# Altium schematic sheet Ai.SchDoc
size A3
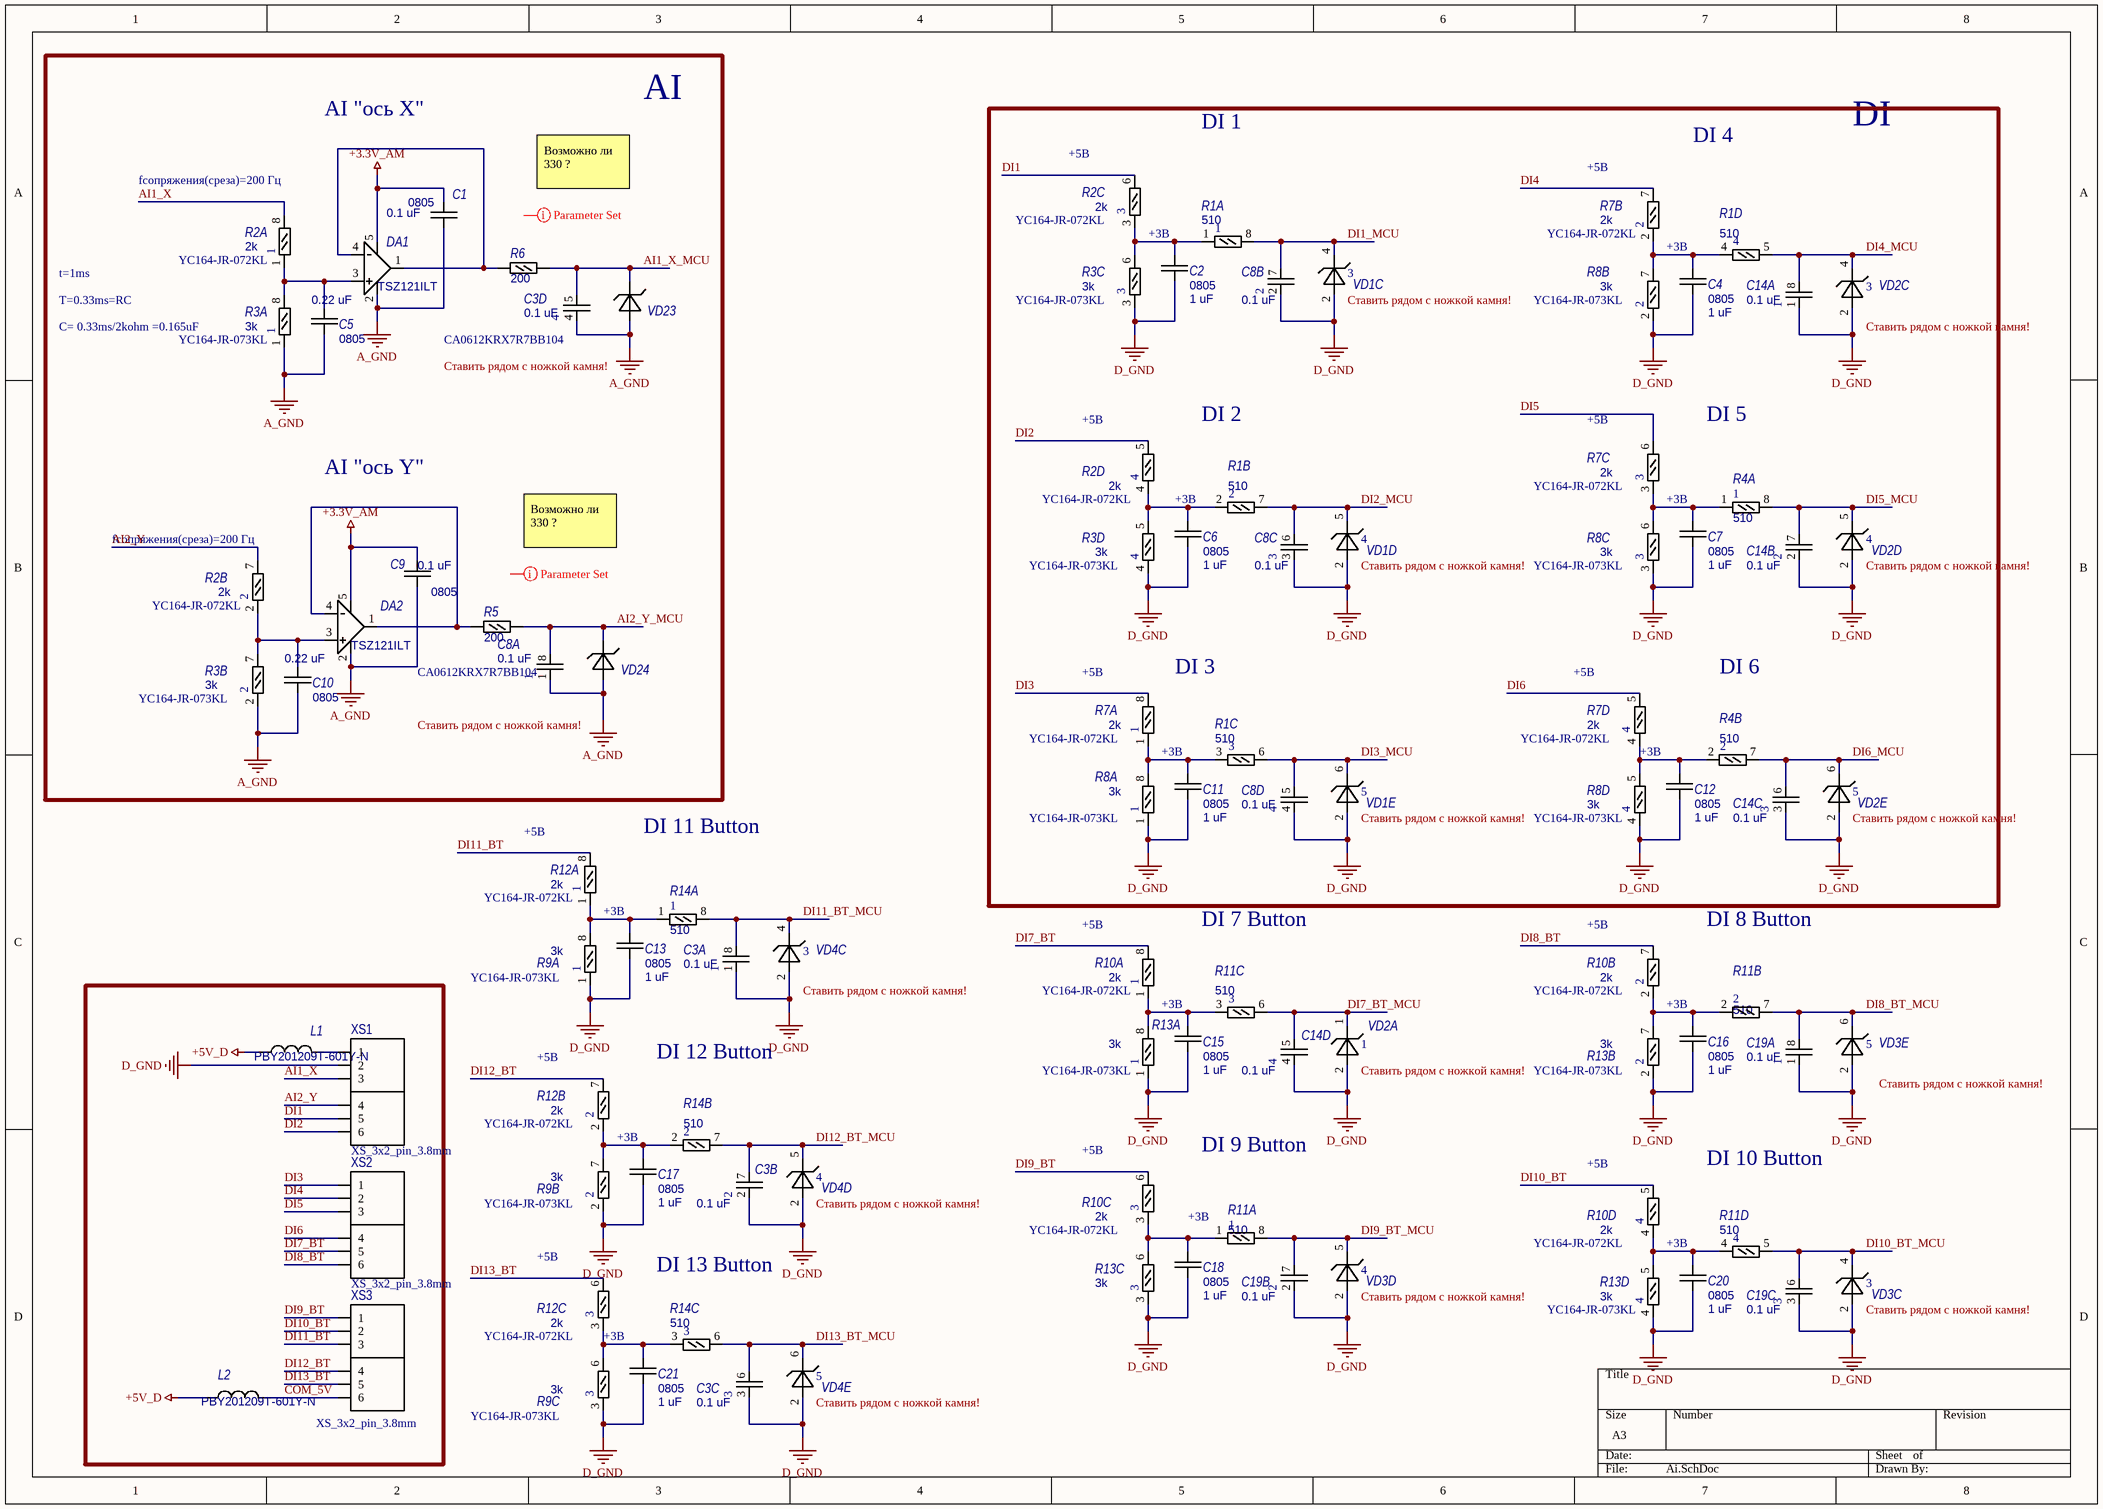
[diagram p0: Ai.SchDoc]

## Parts
C1  0805  Номинал: 0.1 uF  [CAP_0805_(2x1.25x1.3)]
C2  0805  Номинал: 1 uF  [CAP_0805_(2x1.25x1.3)]
C3  Номинал: 0.1 uF  [CA0612]  (hidden comment: Cборка 4 шт)  (parts A,B,C,D of 4)
C4  0805  Номинал: 1 uF  [CAP_0805_(2x1.25x1.3)]
C5  0805  Номинал: 0.22 uF  [CAP_0805_(2x1.25x1.3)]
C6  0805  Номинал: 1 uF  [CAP_0805_(2x1.25x1.3)]
C7  0805  Номинал: 1 uF  [CAP_0805_(2x1.25x1.3)]
C8  Номинал: 0.1 uF  Идентификатор: CA0612KRX7R7BB104  [CA0612]  (hidden comment: Cборка 4 шт)  (parts A,B,C,D of 4)
C9  0805  Номинал: 0.1 uF  [CAP_0805_(2x1.25x1.3)]
C10  0805  Номинал: 0.22 uF  [CAP_0805_(2x1.25x1.3)]
C11  0805  Номинал: 1 uF  [CAP_0805_(2x1.25x1.3)]
C12  0805  Номинал: 1 uF  [CAP_0805_(2x1.25x1.3)]
C13  0805  Номинал: 1 uF  [CAP_0805_(2x1.25x1.3)]
C14  Номинал: 0.1 uF  [CA0612]  (hidden comment: Cборка 4 шт)  (parts A,B,C,D of 4)
C15  0805  Номинал: 1 uF  [CAP_0805_(2x1.25x1.3)]
C16  0805  Номинал: 1 uF  [CAP_0805_(2x1.25x1.3)]
C17  0805  Номинал: 1 uF  [CAP_0805_(2x1.25x1.3)]
C18  0805  Номинал: 1 uF  [CAP_0805_(2x1.25x1.3)]
C19  Номинал: 0.1 uF  [CA0612]  (hidden comment: Cборка 4 шт)  (parts A,B,C of 4)
C20  0805  Номинал: 1 uF  [CAP_0805_(2x1.25x1.3)]
C21  0805  Номинал: 1 uF  [CAP_0805_(2x1.25x1.3)]
DA1  Наименование: TSZ121ILT  [SOT-23-5]  (hidden comment: Op Amp)
DA2  Наименование: TSZ121ILT  [SOT-23-5]  (hidden comment: Op Amp)
L1  PBY201209T-601Y-N  [L_0805]
L2  PBY201209T-601Y-N  [L_0805]
R1  Номинал: 510  [YC-164]  (hidden comment: сборка 4шт)  (parts A,B,C,D of 4)
R2  Номинал: 2k  Идентификатор: YC164-JR-072KL  [YC-164]  (hidden comment: сборка 4шт)  (parts A,B,C,D of 4)
R3  Номинал: 3k  Идентификатор: YC164-JR-073KL  [YC-164]  (hidden comment: сборка 4шт)  (parts A,B,C,D of 4)
R4  Номинал: 510  [YC-164]  (hidden comment: сборка 4шт)  (parts A,B of 4)
R5  Номинал: 200  [RES_0805_(2x1.2x0.45)_0.125Вт]  (hidden comment: 0805)
R6  Номинал: 200  [RES_0805_(2x1.2x0.45)_0.125Вт]  (hidden comment: 0805)
R7  Номинал: 2k  Идентификатор: YC164-JR-072KL  [YC-164]  (hidden comment: сборка 4шт)  (parts A,B,C,D of 4)
R8  Номинал: 3k  Идентификатор: YC164-JR-073KL  [YC-164]  (hidden comment: сборка 4шт)  (parts A,B,C,D of 4)
R9  Номинал: 3k  Идентификатор: YC164-JR-073KL  [YC-164]  (hidden comment: сборка 4шт)  (parts A,B,C of 4)
R10  Номинал: 2k  Идентификатор: YC164-JR-072KL  [YC-164]  (hidden comment: сборка 4шт)  (parts A,B,C,D of 4)
R11  Номинал: 510  [YC-164]  (hidden comment: сборка 4шт)  (parts A,B,C,D of 4)
R12  Номинал: 2k  Идентификатор: YC164-JR-072KL  [YC-164]  (hidden comment: сборка 4шт)  (parts A,B,C of 4)
R13  Номинал: 3k  Идентификатор: YC164-JR-073KL  [YC-164]  (hidden comment: сборка 4шт)  (parts A,B,C,D of 4)
R14  Номинал: 510  [YC-164]  (hidden comment: сборка 4шт)  (parts A,B,C of 4)
VD1  сборка 5шт  [SOT-363]  (value not drawn)  (parts C,D,E of 5)
VD2  сборка 5шт  [SOT-363]  (value not drawn)  (parts A,C,D,E of 5)
VD3  сборка 5шт  [SOT-363]  (value not drawn)  (parts C,D,E of 5)
VD4  сборка 5шт  [SOT-363]  (value not drawn)  (parts C,D,E of 5)
VD23  ESD  [VD_SOD523]  (value not drawn)
VD24  ESD  [VD_SOD523]  (value not drawn)
XS1  XS_3x2_pin_3.8mm  [XS_KLS_3x2_Pin _3.8mm]
XS2  XS_3x2_pin_3.8mm  [XS_KLS_3x2_Pin _3.8mm]
XS3  XS_3x2_pin_3.8mm  [XS_KLS_3x2_Pin _3.8mm]

## Blocks framed on the sheet
AI: C1 C3 C5 C8-C10 DA1 DA2 R2 R3 R5 R6 VD23 VD24
DI: C2 C4 C6-C8 C11 C12 C14 R1-R4 R7 R8 VD1 VD2

## Nets
+3.3V_AM: C1.2 C9.2 DA1.5(Vdd) DA2.5(Vdd)
+5V_D: L1.1 L2.1
A_GND: C1.1 C3.4 C5.1 C8.1 C9.1 C10.1 DA1.2(Vss) DA2.2(Vss) R3.1 R3.2 VD23.1(A) VD24.1(A)
D_GND: C2.1 C3.1 C3.2 C3.3 C4.1 C6.1 C7.1 C8.2 C8.3 C8.4 C11.1 C12.1 C13.1 C14.1 C14.2 C14.3 C14.4 C15.1 C16.1 C17.1 C18.1 C19.1 C19.2 C19.3 C20.1 C21.1 R3.3 R3.4 R8.1 R8.2 R8.3 R8.4 R9.1 R9.2 R9.3 R13.1 R13.2 R13.3 R13.4 VD1.2(A) VD2.2(A) VD3.2(A) VD4.2(A) XS1.2
AI1_X: R2.8 XS1.3
AI1_X_MCU: C3.5 R6.1 VD23.2(K)
AI2_Y: R2.7 XS1.4
AI2_Y_MCU: C8.8 R5.1 VD24.2(K)
COM_5V: L2.2 XS3.6
DI1: R2.6 XS1.5
DI1_MCU: C8.7 R1.8 VD1.4(K)
DI2: R2.5 XS1.6
DI2_MCU: C8.6 R1.7 VD1.5(K)
DI3: R7.8 XS2.1
DI3_MCU: C8.5 R1.6 VD1.6(K)
DI4: R7.7 XS2.2
DI4_MCU: C14.8 R1.5 VD2.4(K)
DI5: R7.6 XS2.3
DI5_MCU: C14.7 R4.8 VD2.5(K)
DI6: R7.5 XS2.4
DI6_MCU: C14.6 R4.7 VD2.6(K)
DI7_BT: R10.8 XS2.5
DI7_BT_MCU: C14.5 R11.6 VD2.1(K)
DI8_BT: R10.7 XS2.6
DI8_BT_MCU: C19.8 R11.7 VD3.6(K)
DI9_BT: R10.6 XS3.1
DI9_BT_MCU: C19.7 R11.8 VD3.5(K)
DI10_BT: R10.5 XS3.2
DI10_BT_MCU: C19.6 R11.5 VD3.4(K)
DI11_BT: R12.8 XS3.3
DI11_BT_MCU: C3.8 R14.8 VD4.4(K)
DI12_BT: R12.7 XS3.4
DI12_BT_MCU: C3.7 R14.7 VD4.5(K)
DI13_BT: R12.6 XS3.5
DI13_BT_MCU: C3.6 R14.6 VD4.6(K)
NetC2_2: C2.2 R1.1 R2.3 R3.6
NetC4_2: C4.2 R1.4 R7.2 R8.7
NetC5_2: C5.2 DA1.3(VinA+) R2.1 R3.8
NetC6_2: C6.2 R1.2 R2.4 R3.5
NetC7_2: C7.2 R4.1 R7.3 R8.6
NetC10_2: C10.2 DA2.3(VinA+) R2.2 R3.7
NetC11_2: C11.2 R1.3 R7.1 R8.8
NetC12_2: C12.2 R4.2 R7.4 R8.5
NetC13_2: C13.2 R9.8 R12.1 R14.1
NetC15_2: C15.2 R10.1 R11.3 R13.8
NetC16_2: C16.2 R10.2 R11.2 R13.7
NetC17_2: C17.2 R9.7 R12.2 R14.2
NetC18_2: C18.2 R10.3 R11.1 R13.6
NetC20_2: C20.2 R10.4 R11.4 R13.5
NetC21_2: C21.2 R9.6 R12.3 R14.3
NetDA1_1: DA1.1(VoutA) DA1.4(VinA-) R6.2
NetDA2_1: DA2.1(VoutA) DA2.4(VinA-) R5.2
NetL1_2: L1.2 XS1.1

## Notes on the sheet
- AI "ось X"
- +5В
- DI 1
- DI 4
- (near R2) fсопряжения(среза)=200 Гц
- Возможно ли 330 ?
- +3В
- t=1ms
- T=0.33ms=RC
- (near VD1) Ставить рядом с ножкой камня!
- C= 0.33ms/2kohm =0.165uF
- Ставить рядом с ножкой камня!
- (near VD2) Ставить рядом с ножкой камня!
- DI 2
- DI 5
- AI "ось Y"
- (near R7) DI 3
- DI 6
- (near R7) +3В
- DI 11 Button
- DI 7 Button
- DI 8 Button
- (near VD4) Ставить рядом с ножкой камня!
- DI 12 Button
- (near VD3) Ставить рядом с ножкой камня!
- DI 9 Button
- DI 10 Button
- DI 13 Button
- (near R12) +3В

## Library data of the parts
C1 C9 = C_0805: Керамика; Тип: Конденсатор; Наименование: CC0805KRX7R9BB104; Аналог: GRM21BR71H104K; Корпус: 0805; Идентификатор: CC0805KRX7R9BB104
C2 C4 C6 C7 C11-C13 C15-C18 C20 C21 = C_0805: Керамика; Тип: Конденсатор; Наименование: TCC0805X7R105K500FT; Аналог: GRM21BR71H105K; Корпус: 0805; Идентификатор: TCC0805X7R105K500FT
C3 C14 C19 = C_CA0612KRX7R7BB: Capacitor 4; Тип: Конденсатор; Наименование: CA0612KRX7R7BB104; Корпус: SMD 0612; Идентификатор: CA0612KRX7R7BB104
C5 C10 = C_0805: Керамика; Тип: Конденсатор; Наименование: TCC0805X7R224K500DT; Аналог: GRM21BR71H224K; Корпус: 0805; Идентификатор: TCC0805X7R224K500DT
C8 = C_CA0612KRX7R7BB: Capacitor 4; Тип: Конденсатор; Корпус: SMD 0612; Наименование: CA0612KRX7R7BB104
DA1 DA2 = DA_TSZ121ILT: Rail to Rail Op Amp; Тип: Операционный усилитель; Корпус: SOT23-5; Примечания: Rail to Rail; Идентификатор: TSZ121ILT
L1 L2 = L_PBY201209T-601Y-N: L; Тип: Индуктивность; Наименование: PBY201209T-601Y-N
R1 R4 R11 R14 = R_YC164-JR-07: Resistor 4; Тип: Резистор; Корпус: 0805; Наименование: YC164-JR-07510RL; Идентификатор: YC164-JR-07510RL
R2 R3 R7-R10 R12 R13 = R_YC164-JR-07: Resistor 4; Тип: Резистор; Корпус: 0805
  R2 R7 R10 R12: Наименование: YC164-JR-072KL
  R3 R8 R9 R13: Наименование: YC164-JR-073KL
R5 R6 = R_0805: Resistor; Тип: Резистор; Наименование: RC0805JR-07200RL; Корпус: 0805; Идентификатор: RC0805JR-07200RL
VD1-VD4 = VD_PESD3V3L5UY: Защитный диод; Корпус: SMC; Напряжение: 3.3V; Тип: Диод; Наименование: PESD3V3L5UY; Идентификатор: PESD3V3L5UY
VD23 VD24 = VD_ESD: Защитный диод; Корпус: SOD523; Наименование: ESD5Z3.3T1G TVS; Напряжение: 3.3В; Тип: Диод
XS1-XS3 = XS_3x2_pin_3.8mm: Наименование: DG381A-3.81- 06P; Примечания: DG381A-3.81- 06P